# Altium project wulpus_pro_acq_pcb.PrjPcb (part 1 of 2)
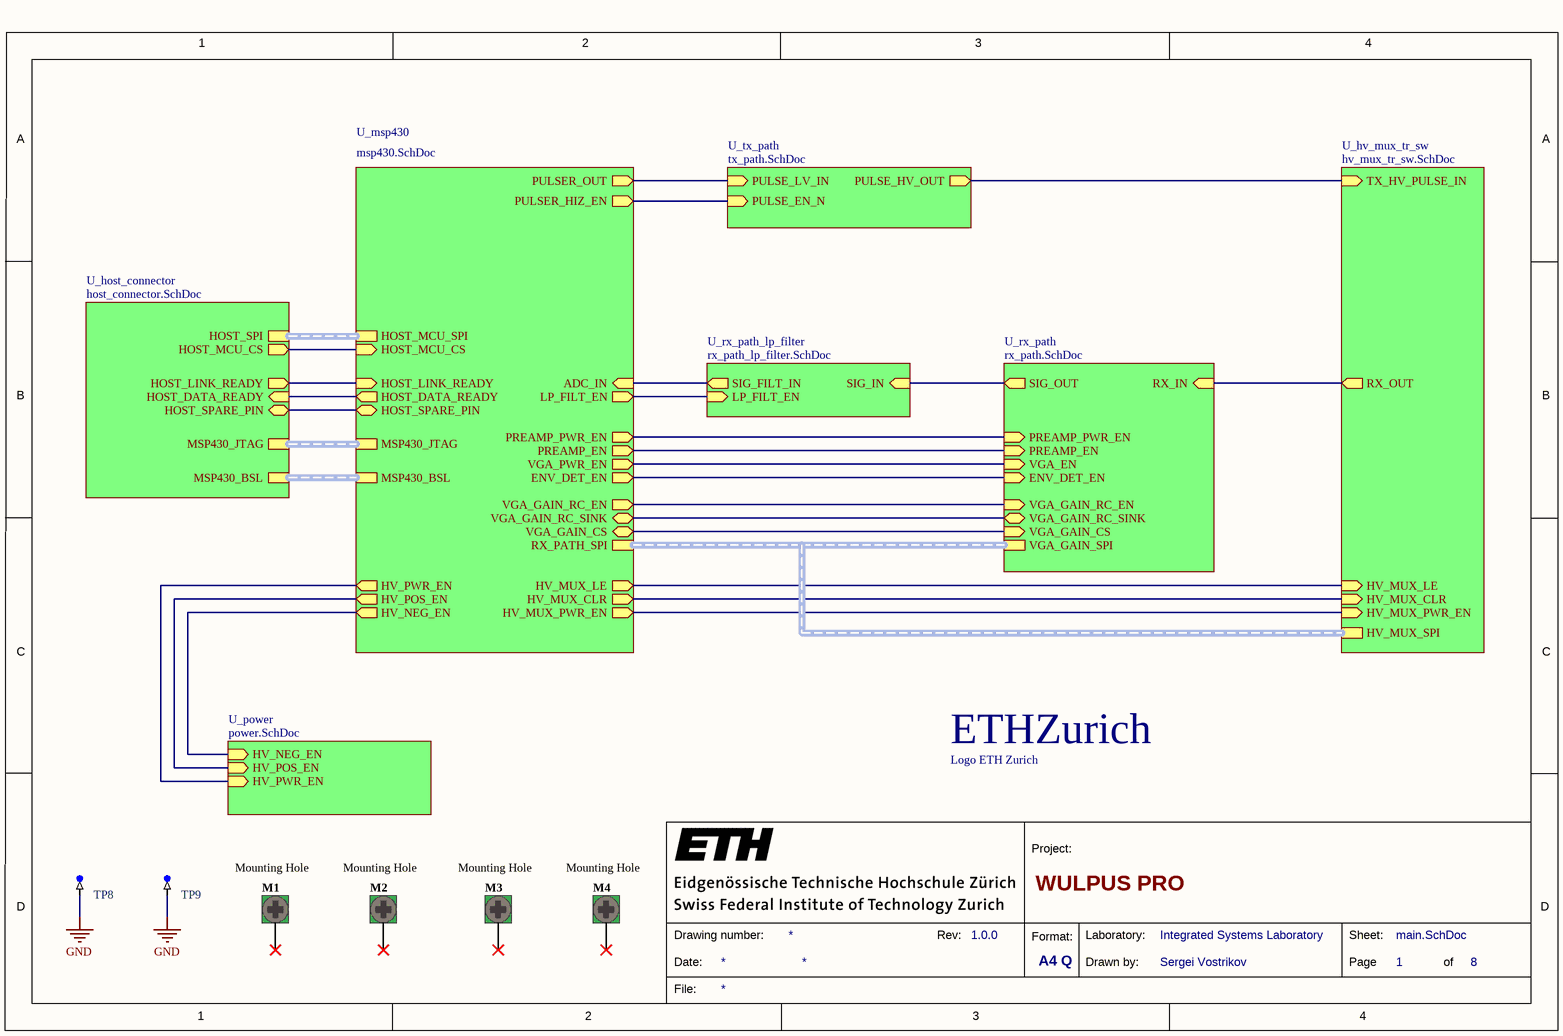
[diagram p0: main.SchDoc]
8 sheets, 202 parts. Net scope: hierarchical (ports join the sheet entries above them; power ports are global).
Board file: wulpus_pro_acq.PcbDoc
Sheets:
  main.SchDoc
    U_rx_path = rx_path.SchDoc
    U_rx_path_lp_filter = rx_path_lp_filter.SchDoc
    U_tx_path = tx_path.SchDoc
    U_hv_mux_tr_sw = hv_mux_tr_sw.SchDoc
    U_msp430 = msp430.SchDoc
    U_host_connector = host_connector.SchDoc
    U_power = power.SchDoc

## Sheet main.SchDoc: WULPUS PRO
size A4; CompanyName: ETH Zurich; DrawnBy: Sergei Vostrikov; Organization: Integrated Systems Laboratory; Revision: 1.0.0; SheetNumber: 1; SheetTotal: 8

### Parts
A1  Logo ETH Zurich  [eth-zurich_3mm]  (no BOM)
M1  Mounting Hole  [Mounting Hole]  (no BOM)
M2  Mounting Hole  [Mounting Hole]  (no BOM)
M3  Mounting Hole  [Mounting Hole]  (no BOM)
M4  Mounting Hole  [Mounting Hole]  (no BOM)
TP8  TP-SM-C-100  [TP-SM-C-100]  (value not drawn)  (no BOM)
TP9  TP-SM-C-100  [TP-SM-C-100]  (value not drawn)  (no BOM)

### Sub-sheets
U_host_connector = host_connector.SchDoc: HOST_SPI (harness SPI), HOST_MCU_CS (out), HOST_DATA_READY (in), HOST_LINK_READY (out), HOST_SPARE_PIN (bidir), MSP430_JTAG (harness JTAG), MSP430_BSL (harness BSL_UART)
U_hv_mux_tr_sw = hv_mux_tr_sw.SchDoc: HV_MUX_SPI (harness SPI), HV_MUX_LE (in), HV_MUX_CLR (in), RX_OUT (out), HV_MUX_PWR_EN (in), TX_HV_PULSE_IN (in)
U_msp430 = msp430.SchDoc: ADC_IN (in), PULSER_OUT (out), RX_PATH_SPI (harness SPI), HV_MUX_CLR (out), HV_MUX_LE (out), PREAMP_PWR_EN (out), HOST_DATA_READY (out), HV_MUX_PWR_EN (out), HV_POS_EN (out), HV_NEG_EN (out), HV_PWR_EN (out), HOST_MCU_SPI (harness SPI), HOST_LINK_READY (in), VGA_PWR_EN (out), ENV_DET_EN (out), PULSER_HIZ_EN (out), VGA_GAIN_RC_EN (out), VGA_GAIN_RC_SINK (bidir), VGA_GAIN_CS (bidir), PREAMP_EN (out), HOST_MCU_CS (in), HOST_SPARE_PIN (bidir), MSP430_JTAG (harness JTAG), LP_FILT_EN (out), MSP430_BSL (harness BSL_UART)
U_power = power.SchDoc: HV_PWR_EN (in), HV_POS_EN (in), HV_NEG_EN (in)
U_rx_path = rx_path.SchDoc: VGA_GAIN_RC_EN (in), VGA_GAIN_RC_SINK (bidir), RX_IN (in), SIG_OUT (out), VGA_GAIN_SPI (harness SPI), VGA_GAIN_CS (in), ENV_DET_EN (in), VGA_EN (in), PREAMP_EN (in), PREAMP_PWR_EN (in)
U_rx_path_lp_filter = rx_path_lp_filter.SchDoc: LP_FILT_EN (in), SIG_IN (in), SIG_FILT_IN (out)
U_tx_path = tx_path.SchDoc: PULSE_EN_N (in), PULSE_LV_IN (in), PULSE_HV_OUT (out)

### Nets
GND: TP8.1 TP9.1
CH0_OUT: sheet U_tx_path/PULSE_LV_IN, sheet U_msp430/PULSER_OUT
DATA_READY: sheet U_msp430/HOST_DATA_READY, sheet U_host_connector/HOST_DATA_READY
ENV_DET_EN: sheet U_rx_path/ENV_DET_EN, sheet U_msp430/ENV_DET_EN
FILTER_SHDN_N: sheet U_rx_path_lp_filter/LP_FILT_EN, sheet U_msp430/LP_FILT_EN
HOST_LINK_RDY: sheet U_msp430/HOST_LINK_READY, sheet U_host_connector/HOST_LINK_READY
HOST_SPARE: sheet U_msp430/HOST_SPARE_PIN, sheet U_host_connector/HOST_SPARE_PIN
HOST_SPI_CS: sheet U_msp430/HOST_MCU_CS, sheet U_host_connector/HOST_MCU_CS
HV_EN1: sheet U_msp430/HV_POS_EN, sheet U_power/HV_POS_EN
HV_EN2: sheet U_msp430/HV_NEG_EN, sheet U_power/HV_NEG_EN
HV_MUX_CLR: sheet U_hv_mux_tr_sw/HV_MUX_CLR, sheet U_msp430/HV_MUX_CLR
HV_MUX_LE: sheet U_hv_mux_tr_sw/HV_MUX_LE, sheet U_msp430/HV_MUX_LE
HV_MUX_PWR_EN: sheet U_hv_mux_tr_sw/HV_MUX_PWR_EN, sheet U_msp430/HV_MUX_PWR_EN
HV_PWR_EN: sheet U_msp430/HV_PWR_EN, sheet U_power/HV_PWR_EN
PREAMP_EN: sheet U_rx_path/PREAMP_EN, sheet U_msp430/PREAMP_EN
PREAMP_PWR_EN: sheet U_rx_path/PREAMP_PWR_EN, sheet U_msp430/PREAMP_PWR_EN
PULS_HIZ_EN: sheet U_tx_path/PULSE_EN_N, sheet U_msp430/PULSER_HIZ_EN
VGA_GAIN_CS: sheet U_rx_path/VGA_GAIN_CS, sheet U_msp430/VGA_GAIN_CS
VGA_GAIN_RC_EN: sheet U_rx_path/VGA_GAIN_RC_EN, sheet U_msp430/VGA_GAIN_RC_EN
VGA_GAIN_RC_SINK: sheet U_rx_path/VGA_GAIN_RC_SINK, sheet U_msp430/VGA_GAIN_RC_SINK
VGA_PWR_EN: sheet U_rx_path/VGA_EN, sheet U_msp430/VGA_PWR_EN
NetC6_1: sheet U_rx_path/RX_IN, sheet U_hv_mux_tr_sw/RX_OUT
NetC25_2: sheet U_tx_path/PULSE_HV_OUT, sheet U_hv_mux_tr_sw/TX_HV_PULSE_IN
NetC27_2: sheet U_rx_path_lp_filter/SIG_FILT_IN, sheet U_msp430/ADC_IN
NetTP10_1: sheet U_rx_path/SIG_OUT, sheet U_rx_path_lp_filter/SIG_IN

Not connected (* = marked no-connect by the designer): M1 1*; M2 1*; M3 1*; M4 1*

### Buses and harness runs
harness sheet U_host_connector/HOST_SPI = sheet U_msp430/HOST_MCU_SPI
harness sheet U_host_connector/MSP430_BSL = sheet U_msp430/MSP430_BSL
harness sheet U_host_connector/MSP430_JTAG = sheet U_msp430/MSP430_JTAG
harness sheet U_hv_mux_tr_sw/HV_MUX_SPI = sheet U_msp430/RX_PATH_SPI = sheet U_rx_path/VGA_GAIN_SPI

### Notes on the sheet
- 1
- 2
- 3
- 4
- A
- B
- C
- Project:
- D
- Date:
- Drawing number:
- Rev:
- Format:
- A4 Q
- Drawn by:
- Laboratory:
- Page
- Sheet:
- of
- File:
- (in symbol CMP-00038-1) ETHZurich

### Library data of the parts
A1 = CMP-00038-1
M1-M4 = CMP-00274-1: M2 Hole, 2.4mm drill, 5mm landing pads, 3mm pad in middle layers, no overlay; ClassName: Mounting Hole
TP8 TP9 = CMP-0484-00002-1: Test Point, Surface Mount, Circular, Pad Diameter 1 mm

## Sheet rx_path.SchDoc: WULPUS PRO
size A3; DrawnBy: Sergei Vostrikov; Organization: Integrated Systems Laboratory; Revision: 1.0.0; SheetNumber: 2; SheetTotal: 8
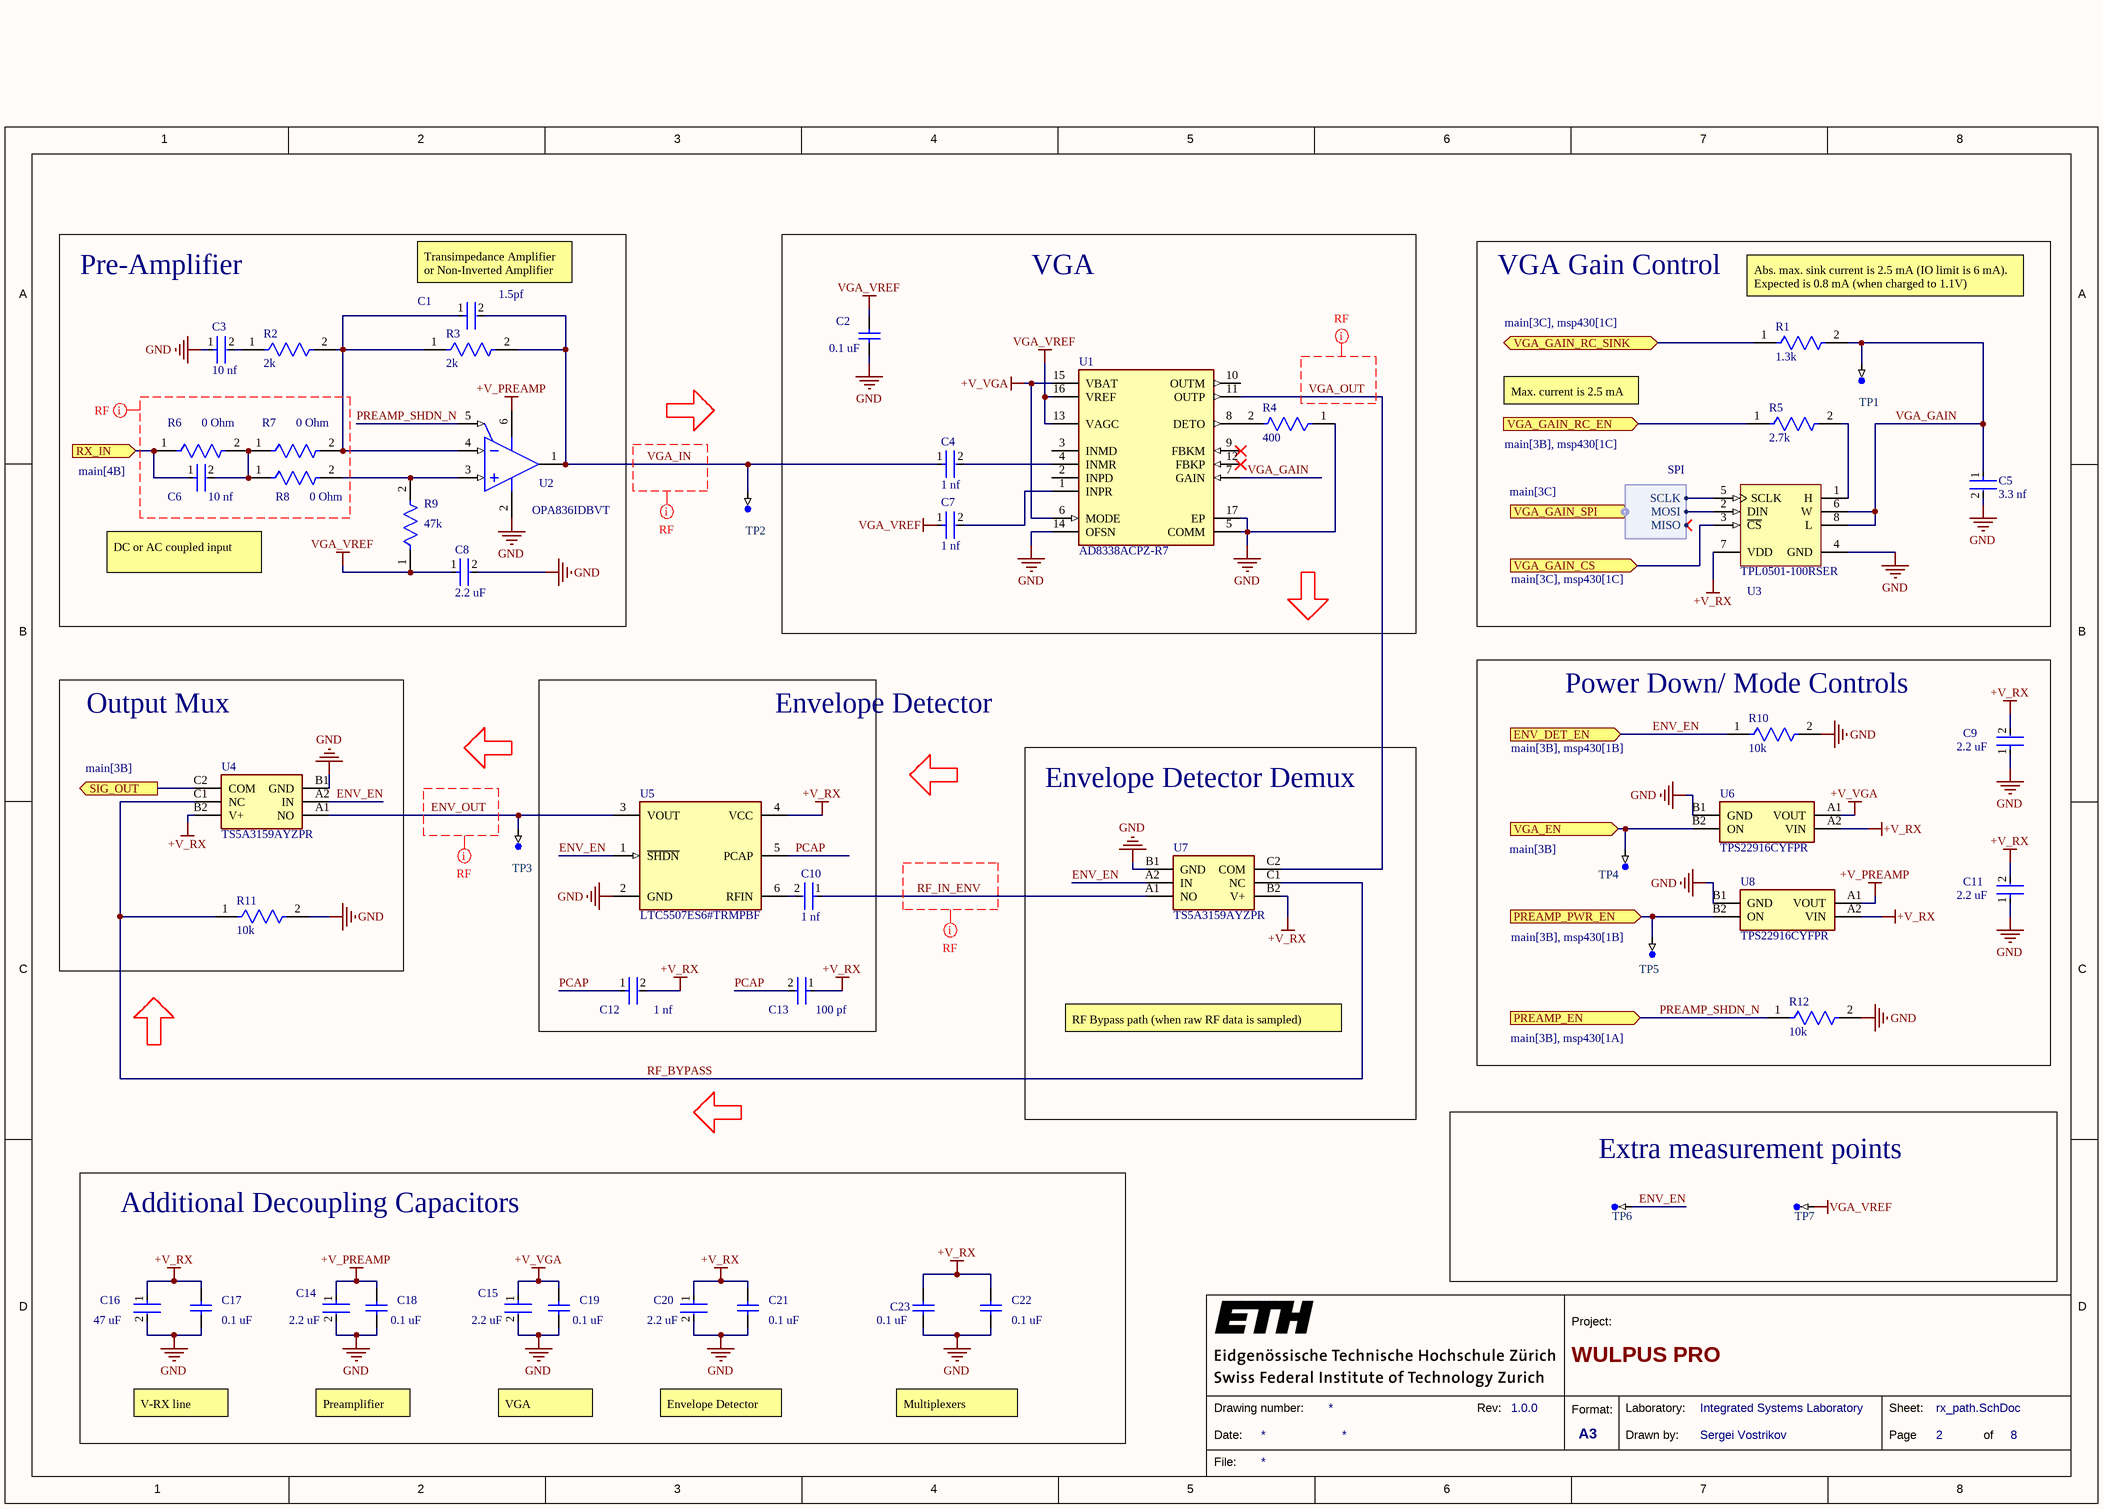
[diagram p1: rx_path.SchDoc]

### Parts
C1  1.5pf  [FP-GJM155-0_05-IPC_C]
C2  0.1 uF  [CAPC1005X55X30LL05T10]
C3  10 nf  [FP-GRM033-0_03-IPC_B]
C4  1 nf  [FP-GRM155-0_05-IPC_B]
C5  3.3 nf  [FP-0402-L_1_0_1-W_0_5_0_1-IPC_C]
C6  10 nf  [FP-GRM033-0_03-IPC_B]
C7  1 nf  [FP-GRM155-0_05-IPC_B]
C8  2.2 uF  [FP-C1005-050-0_15-0_1-MFG]
C9  2.2 uF  [FP-C1005-050-0_15-0_1-MFG]
C10  1 nf  [FP-GRM155-0_05-IPC_B]
C11  2.2 uF  [FP-C1005-050-0_15-0_1-MFG]
C12  1 nf  [FP-GRM155-0_05-IPC_B]
C13  100 pf  [FP-0402-L_1_0_1-W_0_5_0_1-MFG]
C14  2.2 uF  [FP-C1005-050-0_15-0_1-MFG]
C15  2.2 uF  [FP-C1005-050-0_15-0_1-MFG]
C16  47 uF  [FP-GRM188-0_2-MFG]
C17  0.1 uF  [CAPC1005X55X30LL05T10]
C18  0.1 uF  [CAPC1005X55X30LL05T10]
C19  0.1 uF  [CAPC1005X55X30LL05T10]
C20  2.2 uF  [FP-C1005-050-0_15-0_1-MFG]
C21  0.1 uF  [CAPC1005X55X30LL05T10]
C22  0.1 uF  [CAPC1005X55X30LL05T10]
C23  0.1 uF  [CAPC1005X55X30LL05T10]
R1  1.3k  [FP-CRCW0402-e3-IPC_B]
R2  2k  [FP-ERJ2RK-MFG]
R3  2k  [FP-ERJ2RK-MFG]
R4  400  [FP-CRCW0402-C-e3-MFG]
R5  2.7k  [FP-MCS0402-IPC_B]
R6  0 Ohm  [FP-CRCW0402-e3-IPC_C]
R7  0 Ohm  [FP-CRCW0402-e3-IPC_C]
R8  0 Ohm  [FP-CRCW0402-e3-IPC_C]
R9  47k  [FP-RMCF0201-MFG]
R10  10k  [FP-CRCW0402-e3-IPC_B]
R11  10k  [FP-CRCW0402-e3-IPC_B]
R12  10k  [FP-CRCW0402-e3-IPC_B]
TP1  TP-SM-C-100  [TP-SM-C-100]  (value not drawn)  (no BOM)
TP2  TP-SM-C-100  [TP-SM-C-100]  (value not drawn)  (no BOM)
TP3  TP-SM-C-100  [TP-SM-C-100]  (value not drawn)  (no BOM)
TP4  TP-SM-C-100  [TP-SM-C-100]  (value not drawn)  (no BOM)
TP5  TP-SM-C-100  [TP-SM-C-100]  (value not drawn)  (no BOM)
TP6  TP-SM-C-100  [TP-SM-C-100]  (value not drawn)  (no BOM)
TP7  TP-SM-C-100  [TP-SM-C-100]  (value not drawn)  (no BOM)
U1  AD8338ACPZ-R7  [FP-CP-16-22-IPC_C]
U2  OPA836IDBVT  [DBV0006A_L]
U3  TPL0501-100RSER  [TI-RSE8_V]
U4  TS5A3159AYZPR  [BGA6C50P2X3_89X139X50]
U5  LTC5507ES6#TRMPBF  [FP-LTC5507ES6#TRMPBF-IPC_B]
U6  TPS22916CYFPR  [BGA4C40P2X2_78X78X50]
U7  TS5A3159AYZPR  [BGA6C50P2X3_89X139X50]
U8  TPS22916CYFPR  [BGA4C40P2X2_78X78X50]

### Blocks framed on the sheet
Pre-Amplifier: C1 C3 C6 C8 R2 R3 R6-R9 U2
VGA: C2 C4 C7 R4 U1
VGA Gain Control: C5 R1 R5 TP1 U3
Power Down/ Mode Controls: C9 C11 R10 R12 TP4 TP5 U6 U8
Output Mux: R11 U4
Envelope Detector: C10 C12 C13 U5
Envelope Detector Demux: U7
Extra measurement points: TP6 TP7
Additional Decoupling Capacitors: C14-C23

### Ports
ENV_DET_EN (in, see main[3B], msp430[1B]), PREAMP_EN (in, see main[3B], msp430[1A]), PREAMP_PWR_EN (in, see main[3B], msp430[1B]), RX_IN (in, see main[4B]), SIG_OUT (out, see main[3B]), VGA_EN (in, see main[3B]), VGA_GAIN_CS (in, see main[3C], msp430[1C]), VGA_GAIN_RC_EN (in, see main[3B], msp430[1C]), VGA_GAIN_RC_SINK (bidir, see main[3C], msp430[1C]), VGA_GAIN_SPI (harness SPI, see main[3C])

### Harnesses
SPI: SCLK, MOSI, MISO

### Nets
+V_PREAMP: C14.1 C18.2 U2.6(VS+) U8.A1(VOUT)
+V_RX: C9.2 C11.2 C12.2 C13.1 C16.1 C17.2 C20.1 C21.2 C22.2 C23.2 U3.7(VDD) U4.B2(V+) U5.4(VCC) U6.A2(VIN) U7.B2(V+) U8.A2(VIN)
+V_VGA: C15.1 C19.2 U1.6(MODE) U1.15(VBAT) U6.A1(VOUT)
GND: C2.1 C3.1 C5.2 C8.2 C9.1 C11.1 C14.2 C15.2 C16.2 C17.1 C18.1 C19.1 C20.2 C21.1 C22.1 C23.1 R4.1 R10.2 R11.2 R12.2 U1.5(COMM) U1.14(OFSN) U1.17(EP) U2.2(VS-) U3.4(GND) U4.B1(GND) U5.2(GND) U6.B1(GND) U7.B1(GND) U8.B1(GND)
VGA_VREF: C2.2 C7.1 C8.1 R9.1 TP7.1 U1.13(VAGC) U1.16(VREF)
ENV_EN: R10.1 TP6.1 U4.A2(IN) U5.1(~{SHDN}) U7.A2(IN) ; port ENV_DET_EN  [project net ENV_DET_EN]
ENV_OUT: TP3.1 U4.A1(NO) U5.3(VOUT)
PCAP: C12.1 C13.2 U5.5(PCAP)
PREAMP_PWR_EN: TP5.1 U8.B2(ON) ; port PREAMP_PWR_EN
PREAMP_SHDN_N: R12.1 U2.5(~{PD}) ; port PREAMP_EN  [project net PREAMP_EN]
RF_BYPASS: R11.1 U4.C1(NC) U7.C1(NC)
RF_IN_ENV: C10.1 U7.A1(NO)
RX_SPI_CLK: U3.5(SCLK) ; port VGA_GAIN_SPI.SCLK
RX_SPI_MOSI: U3.2(DIN) ; port VGA_GAIN_SPI.MOSI
VGA_GAIN: C5.1 R1.2 TP1.1 U1.7(GAIN) U3.6(W) U3.8(L)
VGA_GAIN_CS: U3.3(~{CS}) ; port VGA_GAIN_CS
VGA_GAIN_RC_EN: R5.1 ; port VGA_GAIN_RC_EN
VGA_GAIN_RC_SINK: R1.1 ; port VGA_GAIN_RC_SINK
VGA_IN: C1.2 C4.1 R3.2 TP2.1 U2.1(VOUT)
VGA_OUT: U1.11(OUTP) U7.C2(COM)
VGA_PWR_EN: TP4.1 U6.B2(ON) ; port VGA_EN
NetC1_1: C1.1 R2.2 R3.1 R7.2 U2.4(VIN-)
NetC3_2: C3.2 R2.1
NetC4_2: C4.2 U1.4(INMR)
NetC6_1: C6.1 R6.1 ; port RX_IN
NetC6_2: C6.2 R6.2 R7.1 R8.1
NetC7_2: C7.2 U1.1(INPR)
NetC10_2: C10.2 U5.6(RFIN)
NetR4_2: R4.2 U1.8(DETO)
NetR5_2: R5.2 U3.1(H)
NetR8_2: R8.2 R9.2 U2.3(VIN+)
NetTP10_1: U4.C2(COM) ; port SIG_OUT

Not connected (* = marked no-connect by the designer): U1 2(INPD) 3(INMD) 9(FBKM)* 10(OUTM) 12(FBKP)*

### Layout directives
net class RF: (no net found under the mark), ENV_OUT, RF_IN_ENV, VGA_IN, VGA_OUT

### Notes on the sheet
- (near C1) Transimpedance Amplifier or Non-Inverted Amplifier
- (near R1) Abs. max. sink current is 2.5 mA (IO limit is 6 mA). Expected is 0.8 mA (when charged to 1.1V)
- Max. current is 2.5 mA
- DC or AC coupled input
- RF Bypass path (when raw RF data is sampled)
- V-RX line
- Preamplifier
- VGA
- Envelope Detector
- Multiplexers
- 1
- 2
- 3
- 4
- 5
- 6
- 7
- 8
- A
- B
- C
- D
- Project:
- Date:
- Drawing number:
- Rev:
- Format:
- A3
- Drawn by:
- Laboratory:
- Page
- Sheet:
- of
- File:

### Library data of the parts
C1 = CMP-2008-03820-2: GJM1555C1H1R5BB01D; Temperature Coefficient: 30ppm/°C; Voltage Rating: 50V; Dielectric: C0G; Depth: 0.5mm; Case Code (Imperial): 0402; Package Quantity: 10000; Length: 1mm; Number of Pins: 2; Max Operating Temperature: 125°C; Mount: Surface Mount; Construction: Flat; Thickness: 0.022inch; Series: GJM; Packaging: Tape and Reel; Radiation Hardening: No; REACH SVHC: No SVHC; Case/Package: 0402; Lead Free: Lead Free; Voltage Rating (DC): 50V; Min Operating Temperature: -55°C; Termination: SMD/SMT; Width: 0.5mm; Capacitance: 1.5pF; Lead Pitch: 0.3mm; Case Code (Metric): 1005; Voltage: 50V; Height: 0.5mm
C2 C17-C19 C21-C23 = CMP-0001-00074-2: C0402C104K4RACTU; Manufacturer: Kemet; Part Number: C0402C104K4RACTU
C3 C6 = CMP-2010-01684-2: GRM033R71A103KA01D; Voltage: 10V; Capacitance: 10nF; Material: Ceramic; Dielectric: X7R; Tolerance: 10%; Package Quantity: 1; Width: 0.012inch; Mount: Surface Mount; Voltage Rating (DC): 10V; Voltage Rating: 10V; Length: 0.6mm; Packaging: Tape and Reel; REACH SVHC: No SVHC; Termination: SMD/SMT; Case/Package: 0201; Radiation Hardening: No; Height: 0.3mm; Case Code (Imperial): 0201; Min Operating Temperature: -55°C; Lead Free: Lead Free; Thickness: 0.013inch; Depth: 0.3mm; Case Code (Metric): 0603; Max Operating Temperature: 125°C
C4 C7 C10 C12 = CMP-2008-04254-2: GRM1555C1H102JA01D; Tolerance: 5%; Temperature Coefficient: 30ppm/°C; Insulation Resistance: 10GR; Material: Ceramic; Voltage Rating: 50V; Dielectric: C0G; Capacitance: 1nF; Packaging: Tape and Reel; Lead Free: Lead Free; Thickness: 0.022inch; Termination: SMD/SMT; Max Operating Temperature: 125°C; Height: 0.5mm; Package Quantity: 1; Radiation Hardening: No; Case Code (Metric): 1005; Number of Pins: 2; Mount: Surface Mount; Voltage: 50V; Case/Package: 0402; Min Operating Temperature: -55°C; Dielectric Material: Ceramic; Width: 0.5mm; Depth: 0.5mm; Case Code (Imperial): 0402; REACH SVHC: No SVHC; Voltage Rating (DC): 50V; Length: 1mm
C5 = CMP-2008-02911-2: 04025C332JAT2A; Dielectric: X7R; Capacitance: 3.3nF; Voltage Rating: 50V; Tolerance: 5%; Dissipation Factor: 2.5%; Length: 1mm; Number of Pins: 2; Width: 0.02inch; Case Code (Imperial): 0402; Contact Plating: Tin; Packaging: Tape and Reel; Height: 0.56mm; Case/Package: 0402; Termination: SMD/SMT; Construction: Flat; Max Operating Temperature: 125°C; Min Operating Temperature: -55°C; RoHS Compliant: Yes; Case Code (Metric): 1005; Mount: Surface Mount; Package Quantity: 1; Series: -; REACH SVHC: No SVHC; Lead Free: Lead Free; Voltage Rating (DC): 50V; Radiation Hardening: No; Depth: 0.5mm; Thickness: 0.022inch
C8 C9 C11 C14 C15 C20 = CMP-08246-004344-1: C1005X7S1A225K050BC; Capacitance: 2.2uF; Dielectric: X7S; Dielectric Material: Ceramic; Voltage Rating: 10V; Tolerance: 10%; Mount: Surface Mount; Height: 0.5mm; Package Quantity: 1; Depth: 0.5mm; RoHS Compliant: Yes; Length: 1mm; Thickness: 0.022inch; Packaging: Tape and Reel; Case Code (Imperial): 0402; Resistor Type: Ceramic; Case/Package: 0402; Min Operating Temperature: -55°C; Series: C; Weight: 2.3E-05oz; Width: 0.02inch; Voltage Rating (DC): 10V; Case Code (Metric): 1005; Max Operating Temperature: 125°C; Termination: SMD/SMT; Lead Free: Lead Free
C13 = CMP-2008-02567-2: 04025A101FAT2A; Dielectric: C0G; Capacitance: 100pF; Voltage: 50V; Tolerance: 1%; Dielectric Material: Ceramic; Packaging: Tape and Reel; Thickness: 0.022inch; Termination: SMD/SMT; Case Code (Imperial): 0402; Case Code (Metric): 1005; Width: 0.02inch; Radiation Hardening: No; Min Operating Temperature: -55°C; Depth: 0.5mm; Number of Pins: 2; Height: 0.56mm; REACH SVHC: No SVHC; Case/Package: 0402; Voltage Rating: 50V; Length: 1mm; Mount: Surface Mount; Max Operating Temperature: 125°C; Package Quantity: 1; Lead Free: Lead Free; Voltage Rating (DC): 50V
C16 = CMP-00260-117335223-1: GRM188R60J476ME01D; Material: Ceramic; Tolerance: 20%; Voltage Rating (DC): 6.3V; Dielectric: X5R; Capacitance: 47µF; Case/Package: 0603; Width: 800µm; Min Operating Temperature: -55°C; Lifecycle Status: Production; Height: 1mm; Length: 1.6mm; Max Operating Temperature: 85°C; Voltage Rating: 6.3V; NexarPartId: 117335223; Thickness: 800µm
R1 = CMP-1011-00077-3: CRCW04021K30JNED; Tolerance: 5%; Voltage Rating (DC): 50V; Resistance: 1.3kR; Power Rating: 63mW; Temperature Coefficient: 200ppm/°C; Height: 0.016inch; Military Standard: Not; Max Operating Temperature: 155°C; Width: 0.5mm; Features: Automotive AEC-Q200; Depth: 0.5mm; Weight: 2.3E-05oz; Contact Plating: Tin; Case Code (Imperial): 0402; Min Operating Temperature: -55°C; Voltage Rating: 50V; Package Quantity: 1; Lead Free: Lead Free; Case/Package: 0402; Packaging: Tape and Reel; Radiation Hardening: No; Length: 1mm; Case Code (Metric): 1005; Number of Terminations: 2; Max Power Dissipation: 63mW; Composition: Thick Film
R2 R3 = CMP-2002-00758-4: ERJ-2RKF2001X; Temperature Coefficient: 100ppm/°C; Max Power Dissipation: 100mW; Working Voltage: 50V; Resistance: 2kR; Tolerance: 1%; Number of Terminations: 2; Technology: THICK FILM; Packaging: Tape and Reel; RoHS Compliant: Yes; Min Operating Temperature: -55°C; Length: 1mm; Construction: Rectangular; Features: Automotive AEC-Q200; Contact Plating: Tin; Lead Free: Lead Free; Series: ERJ; Power Rating: 100mW; REACH SVHC: No SVHC; Resistor Type: Thick Film; Max Operating Temperature: 155°C; Package Quantity: 10000; Height: 0.35mm; Case/Package: 0402; Mount: Surface Mount; Termination: SMD/SMT; Resistance Tolerance: 1%; Depth: 0.5mm; Voltage Rating (DC): 50V; Voltage Rating: 50V; Case Code (Imperial): 0402; Military Standard: Not; Width: 0.02inch; Radiation Hardening: No; Case Code (Metric): 1005
R4 = CMP-00030-23798141-1: CRCW04021R00FKEDC; Resistance: 1Ω; Tolerance: 1%; Temperature Coefficient: 100ppm/°C; Voltage Rating: 50V; Power Rating: 63mW; Lead Free: Lead Free; Case/Package: 0402; Max Operating Temperature: 155°C; RoHS: Compliant; Height: 350µm; Schedule B: 8533210045, 8533210045; Composition: Thick Film; NexarPartId: 23798141; Min Operating Temperature: -55°C
R5 = CMP-02407-008611-1: MCS04020C2701FE000; Resistance: 2.7kR; Tolerance: 1%; Temperature Coefficient: 50ppm/°C; Max Power Dissipation: 100mW; Number of Terminations: 2; Packaging: Tape and Reel; Package Quantity: 10000; Height: 0.015inch; Length: 0.039inch; Max Operating Temperature: 125°C; Military Standard: Not; Min Operating Temperature: -55°C; Composition: Thin Film; Width: 0.02inch; Depth: 0.5mm; Contact Plating: Tin; Radiation Hardening: No; Case/Package: 0402; Lead Free: Lead Free
R6-R8 = CMP-2002-08122-2: CRCW04020000Z0ED; Tolerance: 5%; Max Power Dissipation: 63mW; Voltage Rating: 50V; Temperature Coefficient: 100ppm/°C; Resistance: 0mR; Contact Plating: Tin; Height: 0.35mm; Radiation Hardening: No; Features: Automotive AEC-Q200; Composition: Thick Film; Width: 0.5mm; Weight: 2.3E-05oz; Termination: SMD/SMT; Packaging: Tape and Reel; Mount: Surface Mount; Case Code (Metric): 1005; Military Standard: Not; Min Operating Temperature: -55°C; Number of Terminations: 2; Package Quantity: 1; Case Code (Imperial): 0402; Depth: 0.5mm; Max Operating Temperature: 155°C; Case/Package: 0402; Power Rating: 63mW; Lead Free: Lead Free; Voltage Rating (DC): 50V; Length: 1mm
R9 = CMP-26527-004787-1: RMCF0201JT47K0; Power Rating: 50mW; Resistance: 47kR; Tolerance: 5%; Temperature Coefficient: 200ppm/°C; Length: 0.024inch; RoHS Compliant: Yes; Max Operating Temperature: 125°C; Width: 0.012inch; Case Code (Metric): 0603; Height: 0.009inch; Case Code (Imperial): 0201; Mount: Surface Mount; Case/Package: 0201; Radiation Hardening: No; Number of Terminations: 2; Min Operating Temperature: -55°C; Series: RMCF; Contact Plating: Tin; Package Quantity: 10000; Packaging: Tape and Reel; Max Power Dissipation: 50mW; Resistor Type: Thick Film
R10-R12 = CMP-2002-08136-3: CRCW040210K0JNED; Temperature Coefficient: 200ppm/°C; Voltage Rating: 50V; Power Rating: 63mW; Resistance: 10kR; Tolerance: 5%; Military Standard: Not; Packaging: Tape and Reel; Case Code (Imperial): 0402; Min Operating Temperature: -55°C; Case Code (Metric): 1005; Case/Package: 0402; Termination: SMD/SMT; Composition: Thick Film; Depth: 0.5mm; Number of Terminations: 2; Contact Plating: Tin; Height: 0.016inch; Width: 0.5mm; Max Operating Temperature: 155°C; Features: Automotive AEC-Q200; Length: 1mm; Radiation Hardening: No; Max Power Dissipation: 63mW; Mount: Surface Mount; Package Quantity: 1; Weight: 2.3E-05oz
TP1-TP7 = CMP-0484-00002-1: as TP8 on sheet main
U1 = CMP-09116-000032-1: IC OPAMP VGA 1 CIRCUIT 16LFCSP; Manufacturer: Analog Devices; Nominal Supply Current: 3-6mA; Max Supply Voltage: 5V; Number Of Channels: 1; Output Current Per Channel: 5mA; Max Junction Temp: +150°C; Min Supply Voltage: 3V; Bandwidth: 18MHz; Voltage Gain: 80dB; Mouser Description: Special Purpose Amplifiers Ultra Low Pwr 18MHz SGL CH VGA; Device Class L2: Linear ICs; Ipc Land Pattern Name: QFN50P300X300X75-16; Temperature Range Low: -40°C; Device Class L1: Integrated Circuits (ICs); RoHS: TRUE; Digikey Description: IC OPAMP VGA 1 CIRCUIT 16LFCSP; Category: IC; ComponentLink2URL: https://www.analog.com/media/en/technical-documentation/data-sheets/AD8338.pdf; Automotive: No; Height: 0.8mm; Manufacturer Part Number: AD8338ACPZ-R7; Octopart: https://octopart.com/ad8338acpz-r7-analog+devices-21054770; Temperature: -40°C to +85°C; ComponentLink2Description: Datasheet; Lead Free: Yes; Temperature Range High: +85°C; Package: CP-16-22; Device Class L3: Amplifiers - Op Amps
U2 = CMP-0018-00480-2: Very Low Power, Rail to Rail Out, Negative Rail In, VFB Operational Amplifier, 2.5 to 5.5 V, -40 to 125 degC, 6-pin SOT23 (DBV6), Green (RoHS & no Sb/Br); Manufacturer: Texas Instruments; Iq per channel(Max)(mA): 1; Settling Time (0.1%)(Typ)(ns): 30; Vs(Min)(V): 2.5; Vio(Max)(mV): 0.4; 3rd Harmonic(dBc): 105; BW @ Acl(MHz): 205; Vs(Max)(V): 5.5; 2nd Harmonic(dBc): 85; Sub Family: Audio Operational Amplifier, High Output Current Amplifier (>=50mA), High Speed Amplifier (>=50MHz), Low Noise Amp (<=10nV/rtHz), Low Offset Voltage Amplifier (<=500uV), Low Supply Voltage Amplifier (<=2.7V); Vn at Flatband(Typ)(nV/rtHz): 4.6; Iib(Max)(nA): 1000; Slew Rate(Typ)(V/us): 560; Io(Typ)(mA): 50; Number of Channels: 1; Eco-Plan: Green (RoHS & no Sb/Br); PartNumber: OPA836IDBVT; ComponentLink3URL: http://www.ti.com/litv/pdf/mpds026h; ComponentLink3Description: Package Specification; @ MHz: 1; ComponentLink1Description: Manufacturer URL; ComponentLink2URL: http://www.ti.com/general/docs/lit/getliterature.tsp?genericPartNumber=OPA836&fileType=pdf; Acl, min stable gain(V/V): 1; PackageVersion: 4073253-5/K, 03/2006; PackageDescription: 6-Pin Plastic Small Outline, Body 1.6 x 2.9 mm, Pitch 0.95 mm; ComponentLink1URL: http://www.ti.com/; ComponentLink2Description: Datasheet; PackageReference: DBV0006A; Code_JEDEC: MO-178; DatasheetVersion: SLOS712D; Mounting Technology: Surface Mount
U3 = CMP-0004-01511-1: 256-Tap, 100 k, Single Channel Potentiometer with SPI Interface, -40 to 125 degC, 8-pin QFN (RSE8), Green (RoHS & no Sb/Br); Manufacturer: Texas Instruments; Settling Time(us): 3; SubFamily: Digital Potentiometer; DNL(Max)(+/-LSB): 0.5; DAC Channels: 1; PackageVersion: 4207268-2/D, 01/2011; PackageDescription: 8-Pin Plastic Quad Flatpack No-Pin, 1.5 x 1.5 mm Body, 0.5 mm Pitch; ComponentLink3Description: Package Specification; ComponentLink3URL: http://www.ti.com/litv/pdf/mpqf207b; ComponentLink2Description: Datasheet; INL(Max)(+/-LSB): 1; ComponentLink2URL: http://www.ti.com/general/docs/lit/getliterature.tsp?genericPartNumber=TPL0501-100&fileType=pdf; DatasheetVersion: SLIS136A; PackageReference: RSE8; Eco-Plan: Green (RoHS & no Sb/Br); ComponentLink1URL: http://www.ti.com/; PartNumber: TPL0501-100RSER; ComponentLink1Description: Manufacturer URL; Interface: SPI; Code_JEDEC: MO-288; Mounting Technology: Surface Mount
U4 U7 = TS5A3159AYZPR: Analogue Switch ICs SPDT ANALOG SWITCH; Manufacturer_Name: Texas Instruments; Geometry.Height: 0.5mm; Manufacturer_Part_Number: TS5A3159AYZPR; Arrow Part Number: TS5A3159AYZPR; Arrow Price/Stock: https://www.arrow.com/en/products/ts5a3159ayzpr/texas-instruments?utm_currency=USD&region=nac; Datasheet Link: https://www.ti.com/lit/ds/symlink/ts5a3159a.pdf?ts=1623385377964&ref_url=https%253A%252F%252Fwww.ti.com%252Fproduct%252FTS5A3159A
U5 = CMP-09141-000004-1: IC RF DETECT 100KHZ-1GHZ TSOT23; Manufacturer: Analog Devices; Standoff Height: 0.01mm; Max Junction Temp: +125°C; Max Frequency: 1000MHz; Bandwidth: 999.9MHz; Temperature Range Low: -40°C; ComponentLink2URL: https://www.analog.com/media/en/technical-documentation/data-sheets/5507f.pdf; Automotive: No; Device Class L2: RF Semiconductors and Devices; Height: 1mm; RoHS: TRUE; Mouser Description: RF Detector 0.1MHz to 1000MHz 14dBm Automotive 6-Pin TSOT-23 T/R; Lead Free: Yes; Temperature Range High: +85°C; Device Class L3: unset; Category: IC; Octopart: https://octopart.com/ltc5507es6%23trmpbf-analog+devices-88320008; Digikey Description: IC RF DETECT 100KHZ-1GHZ TSOT23; Package: TSOT-23; Temperature: -40°C to +85°C; ComponentLink2Description: Datasheet; Device Class L1: Integrated Circuits (ICs); Manufacturer Part Number: LTC5507ES6#TRMPBF; Ipc Land Pattern Name: SOT95P280X91-6
U6 U8 = TPS22916CYFPR: TPS22916 5.5-V, 2-A Ultra-Low Leakage Load Switch; Manufacturer_Name: Texas Instruments; Geometry.Height: 0.5mm; Manufacturer_Part_Number: TPS22916CYFPR; Arrow Part Number: TPS22916CYFPR; Arrow Price/Stock: https://www.arrow.com/en/products/tps22916cyfpr/texas-instruments?utm_currency=USD&region=nac; Datasheet Link: http://www.ti.com/lit/gpn/tps22916

## Sheet rx_path_lp_filter.SchDoc: WULPUS PRO
size A4; DrawnBy: Sergei Vostrikov; Organization: Integrated Systems Laboratory; Revision: 1.0.0; SheetNumber: 4; SheetTotal: 8
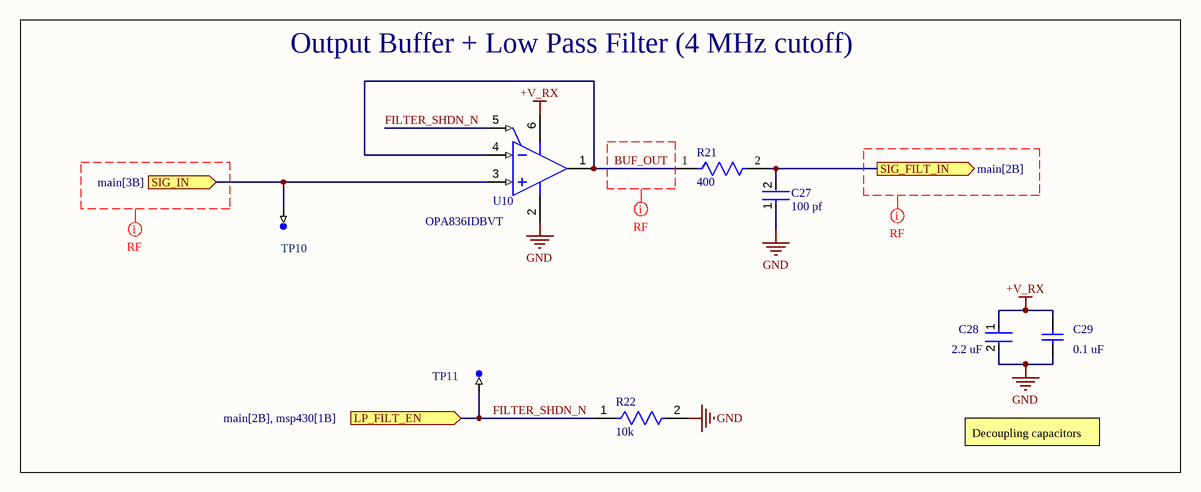
[diagram p2: rx_path_lp_filter.SchDoc]

### Parts
C27  100 pf  [FP-0402-L_1_0_1-W_0_5_0_1-MFG]
C28  2.2 uF  [FP-C1005-050-0_15-0_1-MFG]
C29  0.1 uF  [CAPC1005X55X30LL05T10]
R21  400  [FP-CRCW0402-C-e3-MFG]
R22  10k  [FP-CRCW0402-e3-IPC_B]
TP10  TP-SM-C-100  [TP-SM-C-100]  (value not drawn)  (no BOM)
TP11  TP-SM-C-100  [TP-SM-C-100]  (value not drawn)  (no BOM)
U10  OPA836IDBVT  [DBV0006A_L]

### Blocks framed on the sheet
Output Buffer + Low Pass Filter (4 MHz cutoff): C27-C29 R21 R22 TP10 TP11 U10

### Ports
LP_FILT_EN (in, see main[2B], msp430[1B]), SIG_FILT_IN (out, see main[2B]), SIG_IN (in, see main[3B])

### Nets
+V_RX: C28.1 C29.2 U10.6(VS+)
GND: C27.1 C28.2 C29.1 R22.2 U10.2(VS-)
BUF_OUT: R21.1 U10.1(VOUT) U10.4(VIN-)
FILTER_SHDN_N: R22.1 TP11.1 U10.5(~{PD}) ; port LP_FILT_EN
NetC27_2: C27.2 R21.2 ; port SIG_FILT_IN
NetTP10_1: TP10.1 U10.3(VIN+) ; port SIG_IN

### Layout directives
net class RF: (no net found under the mark), BUF_OUT

### Notes on the sheet
- Decoupling capacitors
- 1
- 2
- 3
- 4
- A
- B
- C
- Project:
- D
- Date:
- Drawing number:
- Rev:
- Format:
- A4 Q
- Drawn by:
- Laboratory:
- Page
- Sheet:
- of
- File:

### Library data of the parts
C27 = CMP-2008-02567-2: as C13 on sheet rx_path; Packaging: Tape and Reel; Thickness: 0.022inch; Termination: SMD/SMT; Case Code (Imperial): 0402; Case Code (Metric): 1005; Width: 0.02inch; Radiation Hardening: No; Min Operating Temperature: -55°C; Depth: 0.5mm; Number of Pins: 2; Height: 0.56mm; REACH SVHC: No SVHC; Case/Package: 0402; Voltage Rating: 50V; Length: 1mm; Mount: Surface Mount; Max Operating Temperature: 125°C; Package Quantity: 1; Lead Free: Lead Free; Voltage Rating (DC): 50V
C28 = CMP-08246-004344-1: as C8 on sheet rx_path; Mount: Surface Mount; Height: 0.5mm; Package Quantity: 1; Depth: 0.5mm; RoHS Compliant: Yes; Length: 1mm; Thickness: 0.022inch; Packaging: Tape and Reel; Case Code (Imperial): 0402; Resistor Type: Ceramic; Case/Package: 0402; Min Operating Temperature: -55°C; Series: C; Weight: 2.3E-05oz; Width: 0.02inch; Voltage Rating (DC): 10V; Case Code (Metric): 1005; Max Operating Temperature: 125°C; Termination: SMD/SMT; Lead Free: Lead Free
C29 = CMP-0001-00074-2: C0402C104K4RACTU; Manufacturer: Kemet; Part Number: C0402C104K4RACTU
R21 = CMP-00030-23798141-1: as R4 on sheet rx_path; Lead Free: Lead Free; Case/Package: 0402; Max Operating Temperature: 155°C; RoHS: Compliant; Height: 350µm; Schedule B: 8533210045, 8533210045; Composition: Thick Film; NexarPartId: 23798141; Min Operating Temperature: -55°C
R22 = CMP-2002-08136-3: as R10 on sheet rx_path; Military Standard: Not; Packaging: Tape and Reel; Case Code (Imperial): 0402; Min Operating Temperature: -55°C; Case Code (Metric): 1005; Case/Package: 0402; Termination: SMD/SMT; Composition: Thick Film; Depth: 0.5mm; Number of Terminations: 2; Contact Plating: Tin; Height: 0.016inch; Width: 0.5mm; Max Operating Temperature: 155°C; Features: Automotive AEC-Q200; Length: 1mm; Radiation Hardening: No; Max Power Dissipation: 63mW; Mount: Surface Mount; Package Quantity: 1; Weight: 2.3E-05oz
TP10 TP11 = CMP-0484-00002-1: as TP8 on sheet main
U10 = CMP-0018-00480-2: as U2 on sheet rx_path; Number of Channels: 1; Eco-Plan: Green (RoHS & no Sb/Br); PartNumber: OPA836IDBVT; ComponentLink3URL: http://www.ti.com/litv/pdf/mpds026h; ComponentLink3Description: Package Specification; @ MHz: 1; ComponentLink1Description: Manufacturer URL; ComponentLink2URL: http://www.ti.com/general/docs/lit/getliterature.tsp?genericPartNumber=OPA836&fileType=pdf; Acl, min stable gain(V/V): 1; PackageVersion: 4073253-5/K, 03/2006; PackageDescription: 6-Pin Plastic Small Outline, Body 1.6 x 2.9 mm, Pitch 0.95 mm; ComponentLink1URL: http://www.ti.com/; ComponentLink2Description: Datasheet; PackageReference: DBV0006A; Code_JEDEC: MO-178; DatasheetVersion: SLOS712D; Mounting Technology: Surface Mount

## Sheet tx_path.SchDoc: WULPUS PRO
size A4; DrawnBy: Sergei Vostrikov; Organization: Integrated Systems Laboratory; Revision: 1.0.0; SheetNumber: 3; SheetTotal: 8
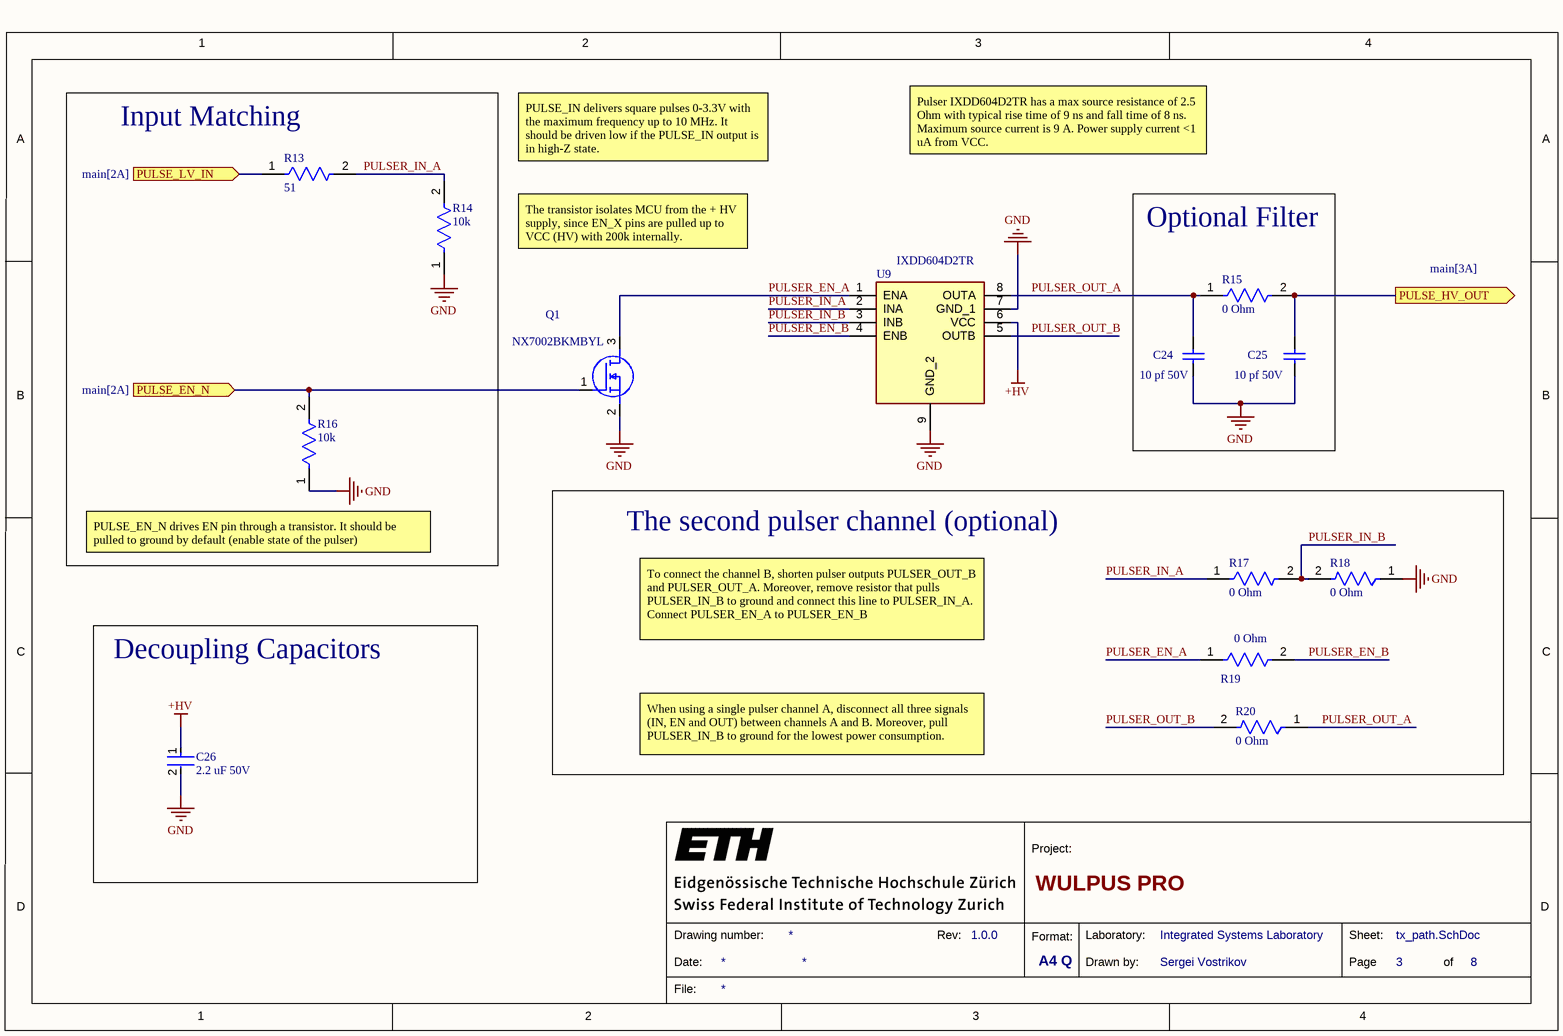
[diagram p3: tx_path.SchDoc]

### Parts
C24  10 pf 50V  [CAPC1005X55X25LL05T10]
C25  10 pf 50V  [CAPC1005X55X25LL05T10]
C26  2.2 uF 50V  [FP-GRM188-0_2-IPC_B]
Q1  NX7002BKMBYL  [NX7002BKMBYL]
R13  51  [FP-CRCW0402-e3-IPC_C]
R14  10k  [FP-CRCW0402-e3-IPC_B]
R15  0 Ohm  [FP-ERJ-3GEY0R00V-MFG]
R16  10k  [FP-CRCW0402-e3-IPC_B]
R17  0 Ohm  [FP-CRCW0402-e3-IPC_C]
R18  0 Ohm  [FP-CRCW0402-e3-IPC_C]
R19  0 Ohm  [FP-CRCW0402-e3-IPC_C]
R20  0 Ohm  [FP-CRCW0402-e3-IPC_C]
U9  IXDD604D2TR  [SON95P500X400X100-9N]

### Blocks framed on the sheet
Input Matching: R13 R14 R16
Optional Filter: C24 C25 R15
The second pulser channel (optional): R17-R20
Decoupling Capacitors: C26

### Ports
PULSE_EN_N (in, see main[2A]), PULSE_HV_OUT (out, see main[3A]), PULSE_LV_IN (in, see main[2A])

### Nets
+HV: C26.1 U9.6(VCC)
GND: C24.1 C25.1 C26.2 Q1.2(S) R14.1 R16.1 R18.1 U9.7(GND_1) U9.9(GND_2)
CH0_OUT: R13.1 ; port PULSE_LV_IN
PULS_HIZ_EN: Q1.1(G) R16.2 ; port PULSE_EN_N
PULSER_EN_A: Q1.3(D) R19.1 U9.1(ENA)
PULSER_EN_B: R19.2 U9.4(ENB)
PULSER_IN_A: R13.2 R14.2 R17.1 U9.2(INA)
PULSER_IN_B: R17.2 R18.2 U9.3(INB)
PULSER_OUT_A: C24.2 R15.1 R20.1 U9.8(OUTA)
PULSER_OUT_B: R20.2 U9.5(OUTB)
NetC25_2: C25.2 R15.2 ; port PULSE_HV_OUT

### Notes on the sheet
- PULSE_IN delivers square pulses 0-3.3V with the maximum frequency up to 10 MHz. It should be driven low if the PULSE_IN output is in high-Z state.
- Pulser IXDD604D2TR has a max source resistance of 2.5 Ohm with typical rise time of 9 ns and fall time of 8 ns. Maximum source current is 9 A. Power supply current <1 uA from VCC.
- The transistor isolates MCU from the + HV supply, since EN_X pins are pulled up to VCC (HV) with 200k internally.
- (near R16) PULSE_EN_N drives EN pin through a transistor. It should be pulled to ground by default (enable state of the pulser)
- To connect the channel B, shorten pulser outputs PULSER_OUT_B and PULSER_OUT_A. Moreover, remove resistor that pulls PULSER_IN_B to ground and connect this line to PULSER_IN_A. Connect PULSER_EN_A to PULSER_EN_B
- When using a single pulser channel A, disconnect all three signals (IN, EN and OUT) between channels A and B. Moreover, pull PULSER_IN_B to ground for the lowest power consumption.
- 1
- 2
- 3
- 4
- A
- B
- C
- Project:
- D
- Date:
- Drawing number:
- Rev:
- Format:
- A4 Q
- Drawn by:
- Laboratory:
- Page
- Sheet:
- of
- File:

### Library data of the parts
C24 C25 = CMP-2008-04245-1: GRM1555C1H100JA01D; Manufacturer: Murata; Part Number: GRM1555C1H100JA01D
C26 = CMP-06035-000704-1: GRM188R61H225ME11D; Capacitance: 2.2uF; Dielectric: X5R; Tolerance: 20%; Weight: 0.000222oz; Min Operating Temperature: -55°C; Voltage Rating (DC): 50V; Case Code (Imperial): 0603; Thickness: 0.039inch; Height: 0.8mm; Termination: SMD/SMT; Resistor Type: Ceramic; Case/Package: 0603; Package Quantity: 4000; Length: 0.063inch; Lead Free: Lead Free; Max Operating Temperature: 85°C; Packaging: Tape and Reel; Width: 0.031inch; Voltage Rating: 50V; Mount: Surface Mount; Case Code (Metric): 1608
Q1 = NX7002BKMBYL: MOSFET (N-Channel); Manufacturer_Name: Nexperia; Datasheet Link: https://assets.nexperia.com/documents/data-sheet/NX7002BKMB.pdf; Height: 0.4mm; Manufacturer_Part_Number: NX7002BKMBYL; Mouser Part Number: 771-NX7002BKMBYL; Mouser Price/Stock: https://www.mouser.co.uk/ProductDetail/Nexperia/NX7002BKMBYL?qs=%252BRKXB2WKlSdBDdfwQeVqTQ%3D%3D; Arrow Part Number: NX7002BKMBYL; Arrow Price/Stock: https://www.arrow.com/en/products/nx7002bkmbyl/nexperia?region=nac
R13 = CMP-2002-00083-2: CRCW040251R0JNED; Max Power Dissipation: 63mW; Temperature Coefficient: 200ppm/°C; Tolerance: 5%; Resistance: 51R; Voltage Rating: 50V; Depth: 0.5mm; Mount: Surface Mount; Number of Terminations: 2; Height: 0.35mm; Length: 1mm; Case Code (Metric): 1005; Radiation Hardening: No; Min Operating Temperature: -55°C; Termination: SMD/SMT; Military Standard: Not; Lead Free: Lead Free; Power Rating: 63mW; Max Operating Temperature: 155°C; Width: 0.5mm; Features: Automotive AEC-Q200; Weight: 2.3E-05oz; Case Code (Imperial): 0402; Package Quantity: 1; Number of Pins: 2; Case/Package: 0402; Contact Plating: Tin; Voltage Rating (DC): 50V; Packaging: Tape and Reel; Composition: Thick Film
R14 R16 = CMP-2002-08136-3: as R10 on sheet rx_path; Military Standard: Not; Packaging: Tape and Reel; Case Code (Imperial): 0402; Min Operating Temperature: -55°C; Case Code (Metric): 1005; Case/Package: 0402; Termination: SMD/SMT; Composition: Thick Film; Depth: 0.5mm; Number of Terminations: 2; Contact Plating: Tin; Height: 0.016inch; Width: 0.5mm; Max Operating Temperature: 155°C; Features: Automotive AEC-Q200; Length: 1mm; Radiation Hardening: No; Max Power Dissipation: 63mW; Mount: Surface Mount; Package Quantity: 1; Weight: 2.3E-05oz
R15 = CMP-2000-00700-2: ERJ-3GEY0R00V; Manufacturer: Panasonic; Tolerance: 5%; Automotive Grade: Grade 0; Voltage Rating: 75V; Value: 0Ω; Temperature Coefficient: -100/+600ppm/°C; Power Rating: 0.1W; Mouser Description: Resistor, Chip Thick Film, 0 Ohm, 0.1w, Resistor, Chip Thick Film, 0 Ohm, 0.1w, 5%; Manufacturer Part Number: ERJ-3GEY0R00V; Ipc Land Pattern Name: RESC16080X45; Category: Res; Package: 0603; Temperature: -55°C to +155°C; Temperature Range Low: -55°C; Series: ERJ; Resistance: 0Ω; RoHS: TRUE; Composition: Thick Film; Octopart: https://octopart.com/erj-3gey0r00v-panasonic-55389238; Device Class L1: Passive Components; Footprint Url: https://industrial.panasonic.com/cdbs/www-data/pdf/RDA0000/DMA0000COL17.pdf; ComponentLink2Description: Datasheet; Device Class L2: Resistors; Temperature Range High: +155°C; Digikey Description: RES SMD 0 OHM JUMPER 1/10W 0603; Lead Free: Yes; Device Class L3: Chip SMD Resistors; Height: 0.55mm; ComponentLink2URL: https://industrial.panasonic.com/cdbs/www-data/pdf/RDA0000/AOA0000C301.pdf; Automotive: Yes
R17-R20 = CMP-2002-08122-2: as R6 on sheet rx_path; Contact Plating: Tin; Height: 0.35mm; Radiation Hardening: No; Features: Automotive AEC-Q200; Composition: Thick Film; Width: 0.5mm; Weight: 2.3E-05oz; Termination: SMD/SMT; Packaging: Tape and Reel; Mount: Surface Mount; Case Code (Metric): 1005; Military Standard: Not; Min Operating Temperature: -55°C; Number of Terminations: 2; Package Quantity: 1; Case Code (Imperial): 0402; Depth: 0.5mm; Max Operating Temperature: 155°C; Case/Package: 0402; Power Rating: 63mW; Lead Free: Lead Free; Voltage Rating (DC): 50V; Length: 1mm
U9 = IXDD604D2TR: Integrated Circuit; Manufacturer_Name: LITTELFUSE; Datasheet Link: http://www.ixysic.com/home/pdfs.nsf/www/IXD_604.pdf/$file/IXD_604.pdf; Height: 1mm; Manufacturer_Part_Number: IXDD604D2TR; Mouser Part Number: 849-IXDD604D2TR; Mouser Price/Stock: https://www.mouser.co.uk/ProductDetail/IXYS-Integrated-Circuits/IXDD604D2TR?qs=RF%252Bx3zajg8LeQlBgW9OO7w%3D%3D; Arrow Part Number: IXDD604D2TR; Arrow Price/Stock: https://www.arrow.com/en/products/ixdd604d2tr/ixys

## Sheet hv_mux_tr_sw.SchDoc: WULPUS PRO
size A3; DrawnBy: Sergei Vostrikov; Organization: Integrated Systems Laboratory; Revision: 1.0.0; SheetNumber: 5; SheetTotal: 8
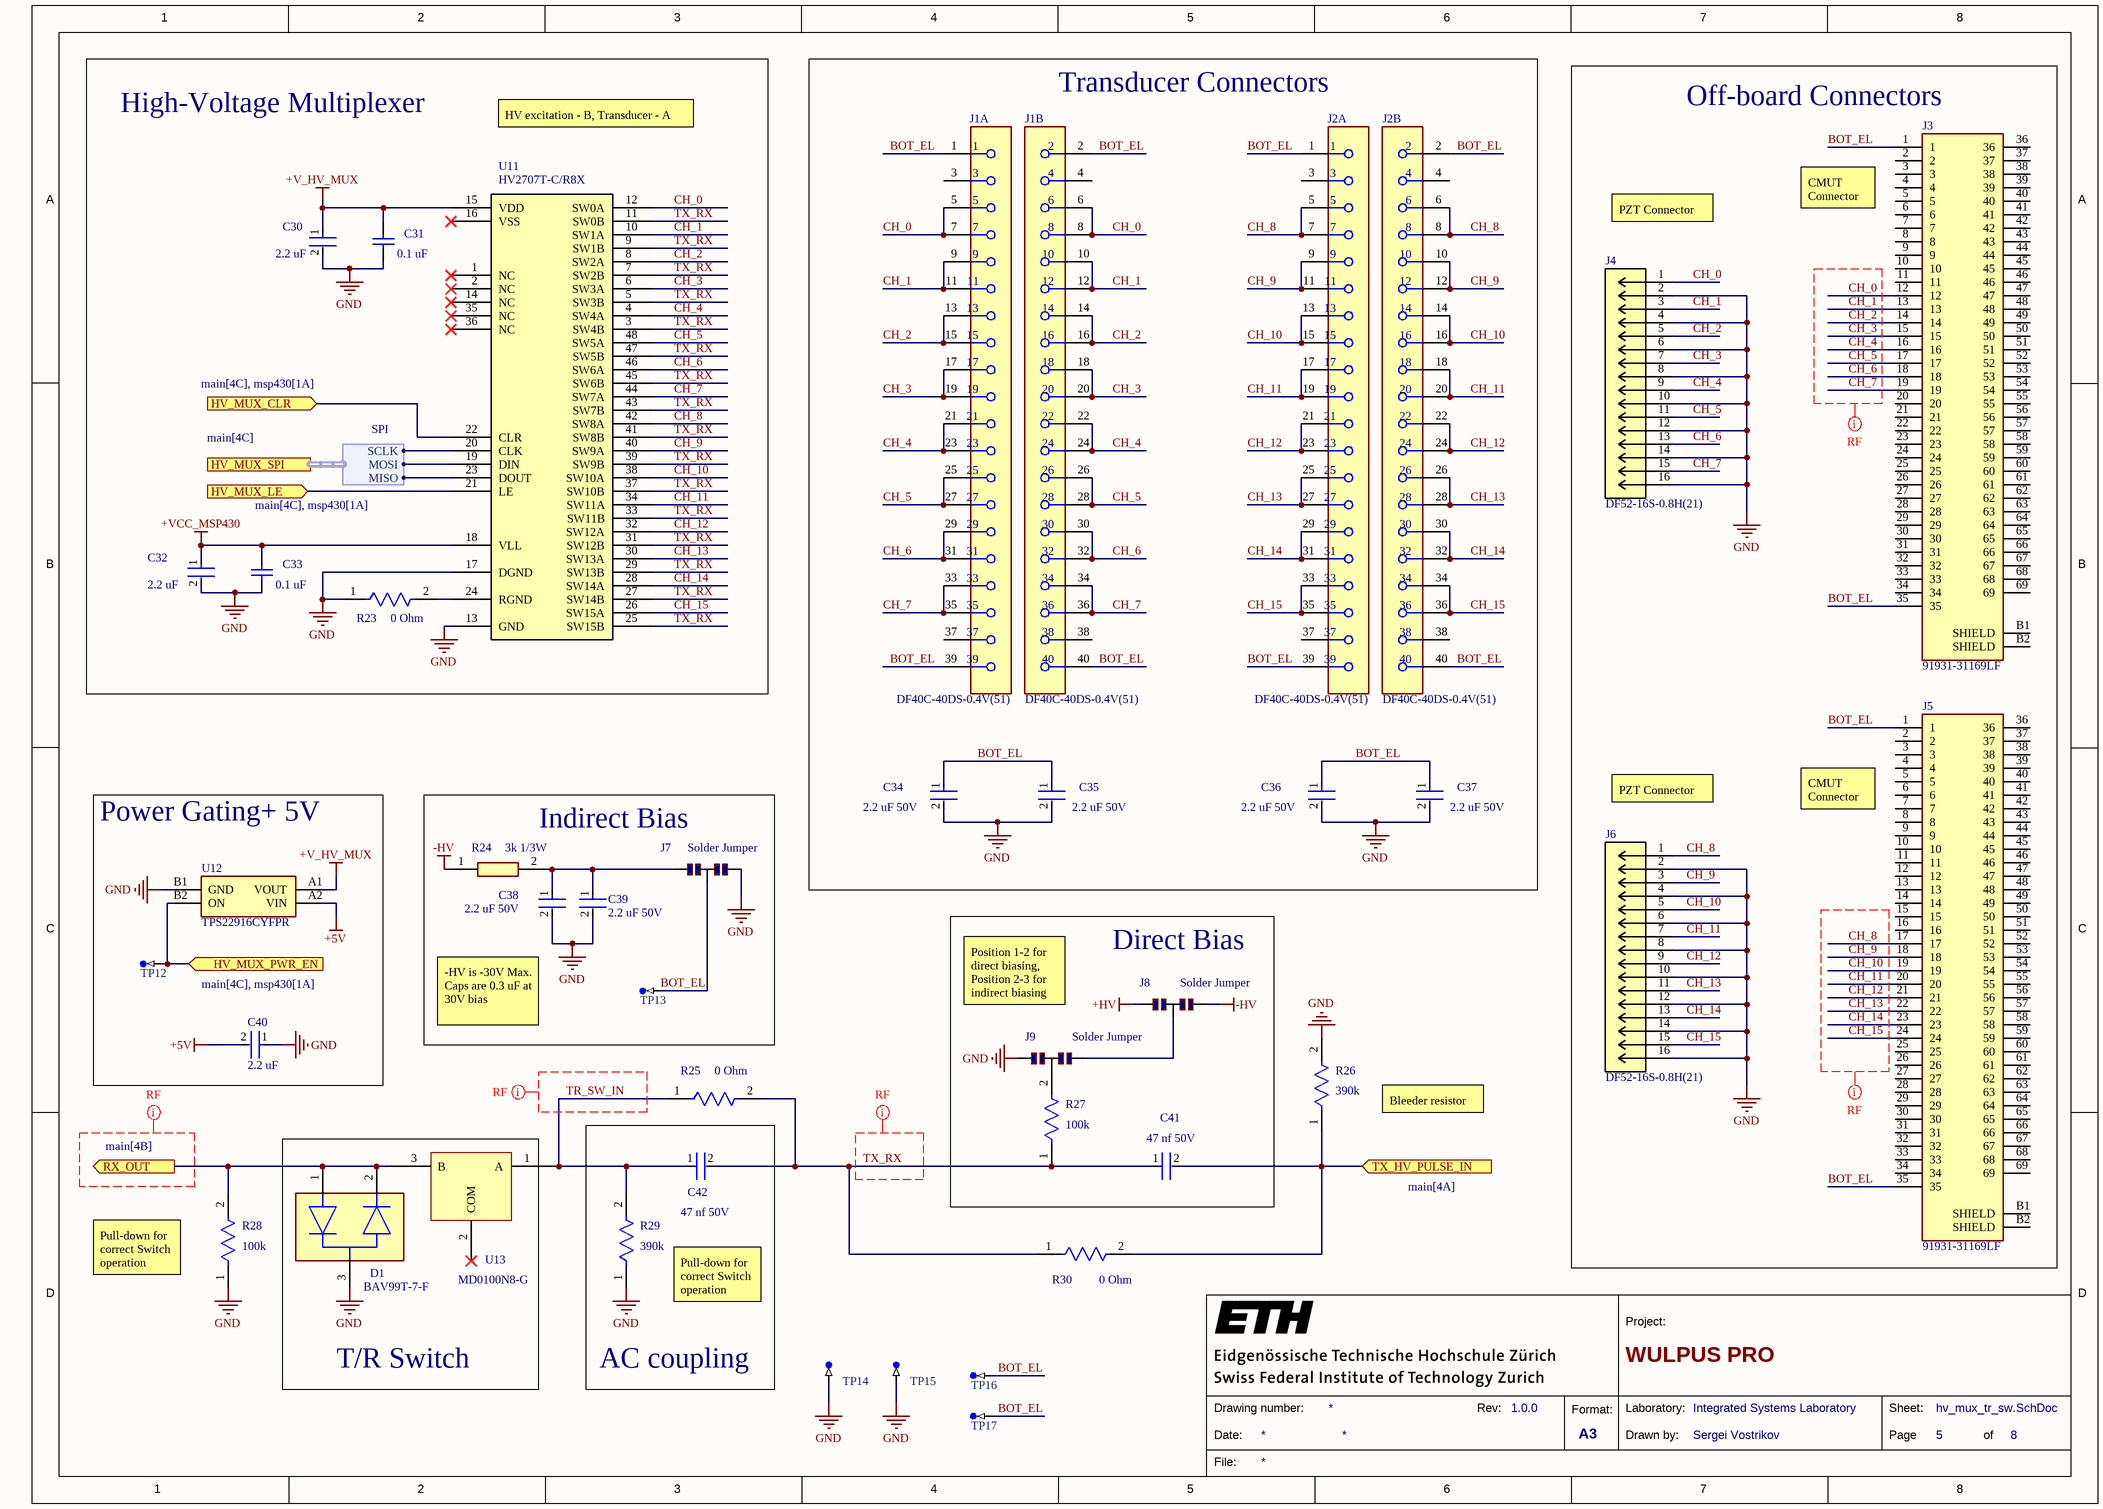
[diagram p4: hv_mux_tr_sw.SchDoc]

### Parts
C30  2.2 uF  [FP-C1005-050-0_15-0_1-MFG]
C31  0.1 uF  [CAPC1005X55X30LL05T10]
C32  2.2 uF  [FP-C1005-050-0_15-0_1-MFG]
C33  0.1 uF  [CAPC1005X55X30LL05T10]
C34  2.2 uF 50V  [FP-GRM188-0_2-IPC_B]
C35  2.2 uF 50V  [FP-GRM188-0_2-IPC_B]
C36  2.2 uF 50V  [FP-GRM188-0_2-IPC_B]
C37  2.2 uF 50V  [FP-GRM188-0_2-IPC_B]
C38  2.2 uF 50V  [FP-GRM188-0_2-IPC_B]
C39  2.2 uF 50V  [FP-GRM188-0_2-IPC_B]
C40  2.2 uF  [FP-C1005-050-0_15-0_1-MFG]
C41  47 nf 50V  [FP-GRM155-0_05-IPC_C]
C42  47 nf 50V  [FP-GRM155-0_05-IPC_C]
D1  BAV99T-7-F  [FP-SOT523-MFG]
J1  DF40C-40DS-0.4V(51)  [FP-DF40C-40DS-0_4V_51-MFG]  (parts A,B of 2)
J2  DF40C-40DS-0.4V(51)  [FP-DF40C-40DS-0_4V_51-MFG]  (parts A,B of 2)
J3  91931-31169LF  [FRAMETOME_91931-31169LF]
J4  DF52-16S-0.8H(21)  [CONN_DF52-16S-0.8H(21)_HIR]
J5  91931-31169LF  [FRAMETOME_91931-31169LF]
J6  DF52-16S-0.8H(21)  [CONN_DF52-16S-0.8H(21)_HIR]
J7  Solder Jumper  [Jumper 3 pins]  (no BOM)
J8  Solder Jumper  [Jumper 3 pins]  (no BOM)
J9  Solder Jumper  [Jumper 3 pins]  (no BOM)
R23  0 Ohm  [FP-CRCW0402-e3-IPC_C]
R24  3k 1/3W  [ERJP03_PA3_(0603)]
R25  0 Ohm  [FP-CRCW0402-e3-IPC_C]
R26  390k  [FP-RC1005-MFG]
R27  100k  [FP-ERJ2RK-IPC_C]
R28  100k  [FP-ERJ2RK-IPC_C]
R29  390k  [FP-RC1005-MFG]
R30  0 Ohm  [FP-CRCW0402-e3-IPC_C]
TP12  TP-SM-C-100  [TP-SM-C-100]  (value not drawn)  (no BOM)
TP13  TP-SM-C-100  [TP-SM-C-100]  (value not drawn)  (no BOM)
TP14  TP-SM-C-100  [TP-SM-C-100]  (value not drawn)  (no BOM)
TP15  TP-SM-C-100  [TP-SM-C-100]  (value not drawn)  (no BOM)
TP16  TP-SM-C-100  [TP-SM-C-100]  (value not drawn)  (no BOM)
TP17  TP-SM-C-100  [TP-SM-C-100]  (value not drawn)  (no BOM)
U11  HV2707T-C/R8X  [LQFP48_7X7MC_MCH]
U12  TPS22916CYFPR  [BGA4C40P2X2_78X78X50]
U13  MD0100N8-G  [AMP_PHA-1+]

### Blocks framed on the sheet
High-Voltage Multiplexer: C30-C33 R23 U11
Transducer Connectors: C34-C37 J1 J2
Off-board Connectors: J3-J6
Power Gating+ 5V: C40 TP12 U12
Indirect Bias: C38 C39 J7 R24 TP13
Direct Bias: C41 J8 J9 R27
T/R Switch: D1 U13
AC coupling: C42 R29

### Ports
HV_MUX_CLR (in, see main[4C], msp430[1A]), HV_MUX_LE (in, see main[4C], msp430[1A]), HV_MUX_PWR_EN (in, see main[4C], msp430[1A]), HV_MUX_SPI (harness SPI, see main[4C]), RX_OUT (out, see main[4B]), TX_HV_PULSE_IN (in, see main[4A])

### Harnesses
SPI: SCLK, MOSI, MISO

### Nets
+5V: C40.2 U12.A2(VIN)
+HV: J8.1
+V_HV_MUX: C30.1 C31.2 U11.15(VDD) U12.A1(VOUT)
+VCC_MSP430: C32.1 C33.2 U11.18(VLL)  [project net DVCC1]
-HV: J8.3 R24.1
GND: C30.2 C31.1 C32.2 C33.1 C34.2 C35.2 C36.2 C37.2 C38.2 C39.2 C40.1 D1.3 J4.2 J4.4 J4.6 J4.8 J4.10 J4.12 J4.14 J4.16 J6.2 J6.4 J6.6 J6.8 J6.10 J6.12 J6.14 J6.16 J7.3 J9.1 R23.1 R26.2 R28.1 R29.1 TP14.1 TP15.1 U11.13(GND) U11.17(DGND) U12.B1(GND)
BOT_EL: C34.1 C35.1 C36.1 C37.1 J1.1 J1.2 J1.39 J1.40 J2.1 J2.2 J2.39 J2.40 J3.1 J3.35 J5.1 J5.35 J7.2 TP13.1 TP16.1 TP17.1
CH_0: J1.5 J1.6 J1.7 J1.8 J3.12 J4.1 U11.12(SW0A)
CH_1: J1.9 J1.10 J1.11 J1.12 J3.13 J4.3 U11.10(SW1A)
CH_2: J1.13 J1.14 J1.15 J1.16 J3.14 J4.5 U11.8(SW2A)
CH_3: J1.17 J1.18 J1.19 J1.20 J3.15 J4.7 U11.6(SW3A)
CH_4: J1.21 J1.22 J1.23 J1.24 J3.16 J4.9 U11.4(SW4A)
CH_5: J1.25 J1.26 J1.27 J1.28 J3.17 J4.11 U11.48(SW5A)
CH_6: J1.29 J1.30 J1.31 J1.32 J3.18 J4.13 U11.46(SW6A)
CH_7: J1.33 J1.34 J1.35 J1.36 J3.19 J4.15 U11.44(SW7A)
CH_8: J2.5 J2.6 J2.7 J2.8 J5.17 J6.1 U11.42(SW8A)
CH_9: J2.9 J2.10 J2.11 J2.12 J5.18 J6.3 U11.40(SW9A)
CH_10: J2.13 J2.14 J2.15 J2.16 J5.19 J6.5 U11.38(SW10A)
CH_11: J2.17 J2.18 J2.19 J2.20 J5.20 J6.7 U11.34(SW11A)
CH_12: J2.21 J2.22 J2.23 J2.24 J5.21 J6.9 U11.32(SW12A)
CH_13: J2.25 J2.26 J2.27 J2.28 J5.22 J6.11 U11.30(SW13A)
CH_14: J2.29 J2.30 J2.31 J2.32 J5.23 J6.13 U11.28(SW14A)
CH_15: J2.33 J2.34 J2.35 J2.36 J5.24 J6.15 U11.26(SW15A)
HV_MUX_CLR: U11.22(CLR) ; port HV_MUX_CLR
HV_MUX_LE: U11.21(LE) ; port HV_MUX_LE
HV_MUX_PWR_EN: TP12.1 U12.B2(ON) ; port HV_MUX_PWR_EN
RX_SPI_CLK: U11.20(CLK) ; port HV_MUX_SPI.SCLK
RX_SPI_MISO: U11.23(DOUT) ; port HV_MUX_SPI.MISO
RX_SPI_MOSI: U11.19(DIN) ; port HV_MUX_SPI.MOSI
TR_SW_IN: C42.1 R25.1 R29.2 U13.1(A)
TX_RX: C41.1 C42.2 R25.2 R27.1 R30.1 U11.3(SW4B) U11.5(SW3B) U11.7(SW2B) U11.9(SW1B) U11.11(SW0B) U11.25(SW15B) U11.27(SW14B) U11.29(SW13B) U11.31(SW12B) U11.33(SW11B) U11.37(SW10B) U11.39(SW9B) U11.41(SW8B) U11.43(SW7B) U11.45(SW6B) U11.47(SW5B)
NetC6_1: D1.1 D1.2 R28.2 U13.3(B) ; port RX_OUT
NetC25_2: C41.2 R26.1 R30.2 ; port TX_HV_PULSE_IN
NetC38_1: C38.1 C39.1 J7.1 R24.2
NetJ8_2: J8.2 J9.3
NetJ9_2: J9.2 R27.2
NetR23_2: R23.2 U11.24(RGND)

Not connected (* = marked no-connect by the designer): J1 3 4 37 38; J2 3 4 37 38; J3 2 3 4 5 6 7 8 9 10 11 20 21 22 23 24 25 26 27 28 29 30 31 32 33 34 36 37 38 39 40 41 42 43 44 45 46 47 48 49 50 51 52 53 54 55 56 57 58 59 60 61 62 63 64 65 66 67 68 69 B1(SHIELD) B2(SHIELD); J5 2 3 4 5 6 7 8 9 10 11 12 13 14 15 16 25 26 27 28 29 30 31 32 33 34 36 37 38 39 40 41 42 43 44 45 46 47 48 49 50 51 52 53 54 55 56 57 58 59 60 61 62 63 64 65 66 67 68 69 B1(SHIELD) B2(SHIELD); U11 1(NC)* 2(NC)* 14(NC)* 16(VSS)* 35(NC)* 36(NC)*; U13 2(COM)*

### Layout directives
net class RF: (no net found under the mark), CH_0, CH_1, CH_2, CH_3, CH_4, CH_5, CH_6, CH_7, CH_8, CH_9, CH_10, CH_11, CH_12, CH_13, CH_14, CH_15, TR_SW_IN, TX_RX

### Notes on the sheet
- HV excitation - B, Transducer - A
- PZT Connector
- (near J3) CMUT
  Connector
- (near J5) CMUT
  Connector
- -HV is -30V Max. Caps are 0.3 uF at 30V bias
- Position 1-2 for direct biasing, Position 2-3 for indirect biasing
- Bleeder resistor
- (near R28) Pull-down for correct Switch operation
- (near R29) Pull-down for correct Switch operation
- 1
- 2
- 3
- 4
- 5
- 6
- 7
- 8
- A
- B
- C
- D
- Project:
- Date:
- Drawing number:
- Rev:
- Format:
- A3
- Drawn by:
- Laboratory:
- Page
- Sheet:
- of
- File:

### Library data of the parts
C30 C32 C40 = CMP-08246-004344-1: as C8 on sheet rx_path; Mount: Surface Mount; Height: 0.5mm; Package Quantity: 1; Depth: 0.5mm; RoHS Compliant: Yes; Length: 1mm; Thickness: 0.022inch; Packaging: Tape and Reel; Case Code (Imperial): 0402; Resistor Type: Ceramic; Case/Package: 0402; Min Operating Temperature: -55°C; Series: C; Weight: 2.3E-05oz; Width: 0.02inch; Voltage Rating (DC): 10V; Case Code (Metric): 1005; Max Operating Temperature: 125°C; Termination: SMD/SMT; Lead Free: Lead Free
C31 C33 = CMP-0001-00074-2: C0402C104K4RACTU; Manufacturer: Kemet; Part Number: C0402C104K4RACTU
C34-C39 = CMP-06035-000704-1: GRM188R61H225ME11; Capacitance: 2.2uF; Dielectric: X5R; Tolerance: 20%; Weight: 0.000222oz; Min Operating Temperature: -55°C; Voltage Rating (DC): 50V; Case Code (Imperial): 0603; Thickness: 0.039inch; Height: 0.8mm; Termination: SMD/SMT; Resistor Type: Ceramic; Case/Package: 0603; Package Quantity: 4000; Length: 0.063inch; Lead Free: Lead Free; Max Operating Temperature: 85°C; Packaging: Tape and Reel; Width: 0.031inch; Voltage Rating: 50V; Mount: Surface Mount; Case Code (Metric): 1608
C41 C42 = CMP-06035-054161-1: GRM155R71H473ME14D; Tolerance: 20%; Capacitance: 47nF; Dielectric: X7R; Termination: SMD/SMT; Package Quantity: 10000; Min Operating Temperature: -55°C; Height: 0.5mm; Case Code (Imperial): 0402; Resistor Type: Ceramic; Case Code (Metric): 1005; Voltage Rating (DC): 50V; Mount: Surface Mount; Case/Package: 0402; Packaging: Tape and Reel; Thickness: 0.022inch; Max Operating Temperature: 125°C; Weight: 0.000212oz; Width: 0.5mm; Length: 0.039inch; Voltage Rating: 50V
D1 = CMP-12791-000024-1: DIODE ARRAY GP 85V 75MA SOT523; Manufacturer: Diodes Inc.; Capacitance: 1.5pF; Value: 1.5pF; Standoff Height: 0mm; Peak Reverse Current: 2uA; Max Surge Forward Current: 0.5A; Max Junction Temp: +150°C; Device Class L1: Discrete Semiconductors; Automotive: No; Temperature: -65°C to +150°C; ComponentLink2Description: Datasheet; Package: SOT523; Manufacturer Part Number: BAV99T-7-F; Forward Current: 75mA; Max Repetitive Reverse Voltage: 85V; Device Class L3: Rectifier Diodes; Octopart: https://octopart.com/bav99t-7-f-diodes+inc.-326340; ComponentLink2URL: https://www.diodes.com/assets/Datasheets/ds30260.pdf; Lead Free: Yes; Digikey Description: DIODE ARRAY GP 85V 75MA SOT523; Reverse Voltage: 85V; Footprint Url: https://www.diodes.com/assets/Package-Files/SOT523.pdf; Category: Diode; RoHS: TRUE; Mouser Description: BAV99T Series 4 A 85 V 150 mW Surface Mount Fast Switching Diode - SOT-523; Device Class L2: Diodes; Height: 0.9mm; Temperature Range Low: -65°C; Temperature Range High: +150°C
J1 J2 = CMP-11605-000009-1: CONN RCPT 40POS SMD GOLD; Manufacturer: Hirose; Current Rating: 0.3A; Standoff Height: 0mm; Voltage Rating: 30V; Conn Gender: Female; Is Female: yes; Conn Orientation: Vertical; Pitch: 0.4mm; Number Of Contacts: 40; Manufacturer Part Number: DF40C-40DS-0.4V(51); Device Class L2: Board to Board Connectors; ComponentLink2URL: https://www.hirose.com/product/document?clcode=CL0684-4008-7-51&productname=DF40C-40DS-0.4V(51)&series=DF40&documenttype=SpecSheet&lang=en&documentid=0000427780; Contact Material: Gold,Nickel; Lead Free: Yes; Temperature: -35°C to +85°C; Number Of Rows: 2; Footprint Url: https://www.hirose.com/product/document?clcode=CL0684-4008-7-51&productname=DF40C-40DS-0.4V(51)&series=DF40&documenttype=2DDrawing&lang=en&documentid=0001001229; ComponentLink2Description: Datasheet; Category: Conn; Temperature Range High: +85°C; Device Class L1: Connectors; Package: 0; Digikey Description: CONN RCPT 40POS SMD GOLD; Device Class L3: unset; Height: 1.65mm; Octopart: https://octopart.com/df40c-40ds-0.4v%2851%29-hirose-19073526; RoHS: TRUE; Temperature Range Low: -35°C; Automotive: No
J3 J5 = 91931-31169LF: Conn; Rect; Industrial; MezzanineRECP; 69Cnts; SMT; I-IndustrialSeries; Package: None; Price: None; Value: *; MP: 91931-31169LF; Availability: Unavailable
J4 J6 = DF52-16S-0.8H(21): No Description Available; Mfr_Name: Hirose; Copyright: Copyright (C) 2022 Ultra Librarian. All rights reserved.; Manufacturer_Part_Number: DF52-16S-0.8H(21); RefDes: RefDes; Type: DEV
J7-J9 = CMP-00467-6: Solder Jumper 3 Pads; Technology: SMT
R23 R25 R30 = CMP-2002-08122-2: as R6 on sheet rx_path; Contact Plating: Tin; Height: 0.35mm; Radiation Hardening: No; Features: Automotive AEC-Q200; Composition: Thick Film; Width: 0.5mm; Weight: 2.3E-05oz; Termination: SMD/SMT; Packaging: Tape and Reel; Mount: Surface Mount; Case Code (Metric): 1005; Military Standard: Not; Min Operating Temperature: -55°C; Number of Terminations: 2; Package Quantity: 1; Case Code (Imperial): 0402; Depth: 0.5mm; Max Operating Temperature: 155°C; Case/Package: 0402; Power Rating: 63mW; Lead Free: Lead Free; Voltage Rating (DC): 50V; Length: 1mm
R24 = ERJ-PA3J302V: Manufacturer_Name: Panasonic; Datasheet Link: https://industrial.panasonic.com/cdbs/www-data/pdf/RDO0000/AOA0000C331.pdf; Height: 0.55mm; Manufacturer_Part_Number: ERJ-PA3J302V; Mouser Part Number: 667-ERJ-PA3J302V; Mouser Price/Stock: https://www.mouser.co.uk/ProductDetail/Panasonic/ERJ-PA3J302V?qs=BzJM0faLVqU1ZJAPCjWnWA%3D%3D
R26 R29 = CMP-13261-002896-1: RC1005F394CS; Voltage Rating (DC): 50V; Tolerance: 1%; Max Power Dissipation: 63mW; Resistance: 390kR; Temperature Coefficient: 100ppm/°C; Lead Free: Lead Free; Case/Package: 0402; Radiation Hardening: No; Length: 0.039inch; Depth: 0.5mm; Composition: Thick Film; Number of Terminations: 2; Height: 0.016inch; Packaging: Tape and Reel; Case Code (Imperial): 0402; Width: 0.02inch; Features: Moisture Resistant; Contact Plating: Tin; Min Operating Temperature: -55°C; Max Operating Temperature: 155°C; Case Code (Metric): 1005; Military Standard: Not
R27 R28 = CMP-2002-00608-4: ERJ-2RKF1003X; Resistance: 100kR; Voltage Rating (DC): 50V; Tolerance: 1%; Power Rating: 100mW; Temperature Coefficient: 100ppm/°C; Case/Package: 0402; Length: 1mm; Package Quantity: 1; Radiation Hardening: No; Case Code (Metric): 1005; Contact Plating: Tin; Mount: Surface Mount; Depth: 0.5mm; Max Operating Temperature: 155°C; Lead Free: Lead Free; Width: 0.5mm; Composition: Thick Film; Case Code (Imperial): 0402; Termination: SMD/SMT; Number of Pins: 2; Height: 0.35mm; Voltage Rating: 50V; Military Standard: Not; REACH SVHC: No SVHC; Packaging: Tape and Reel; Min Operating Temperature: -55°C; Max Power Dissipation: 100mW; Features: Automotive AEC-Q200; Number of Terminations: 2
TP12-TP17 = CMP-0484-00002-1: as TP8 on sheet main
U11 = HV2707T-C/R8X: 16-CH 200V No Hv Bias Switch (SPST), 2 Bleed Resistor 48 LQFP 7X7X1.4MM T/r Rohs Compliant: Yes; Manufacturer: Microchip; Supplier 1: Digi-Key; RoHS: Yes; Category: Decoders and Multiplexers; Stock 1: 440; Pricing 1: 1=19.01000, 25=15.84720, 100=14.65500 (USD); Manufacturer Part Number: HV2707T-C/R8X
U12 = TPS22916CYFPR: as U6 on sheet rx_path; Manufacturer_Part_Number: TPS22916CYFPR; Arrow Part Number: TPS22916CYFPR; Arrow Price/Stock: https://www.arrow.com/en/products/tps22916cyfpr/texas-instruments?utm_currency=USD&region=nac; Datasheet Link: http://www.ti.com/lit/gpn/tps22916
U13 = MD0100